# Altium schematic sheet PP6_LCD.SchDoc
size A3
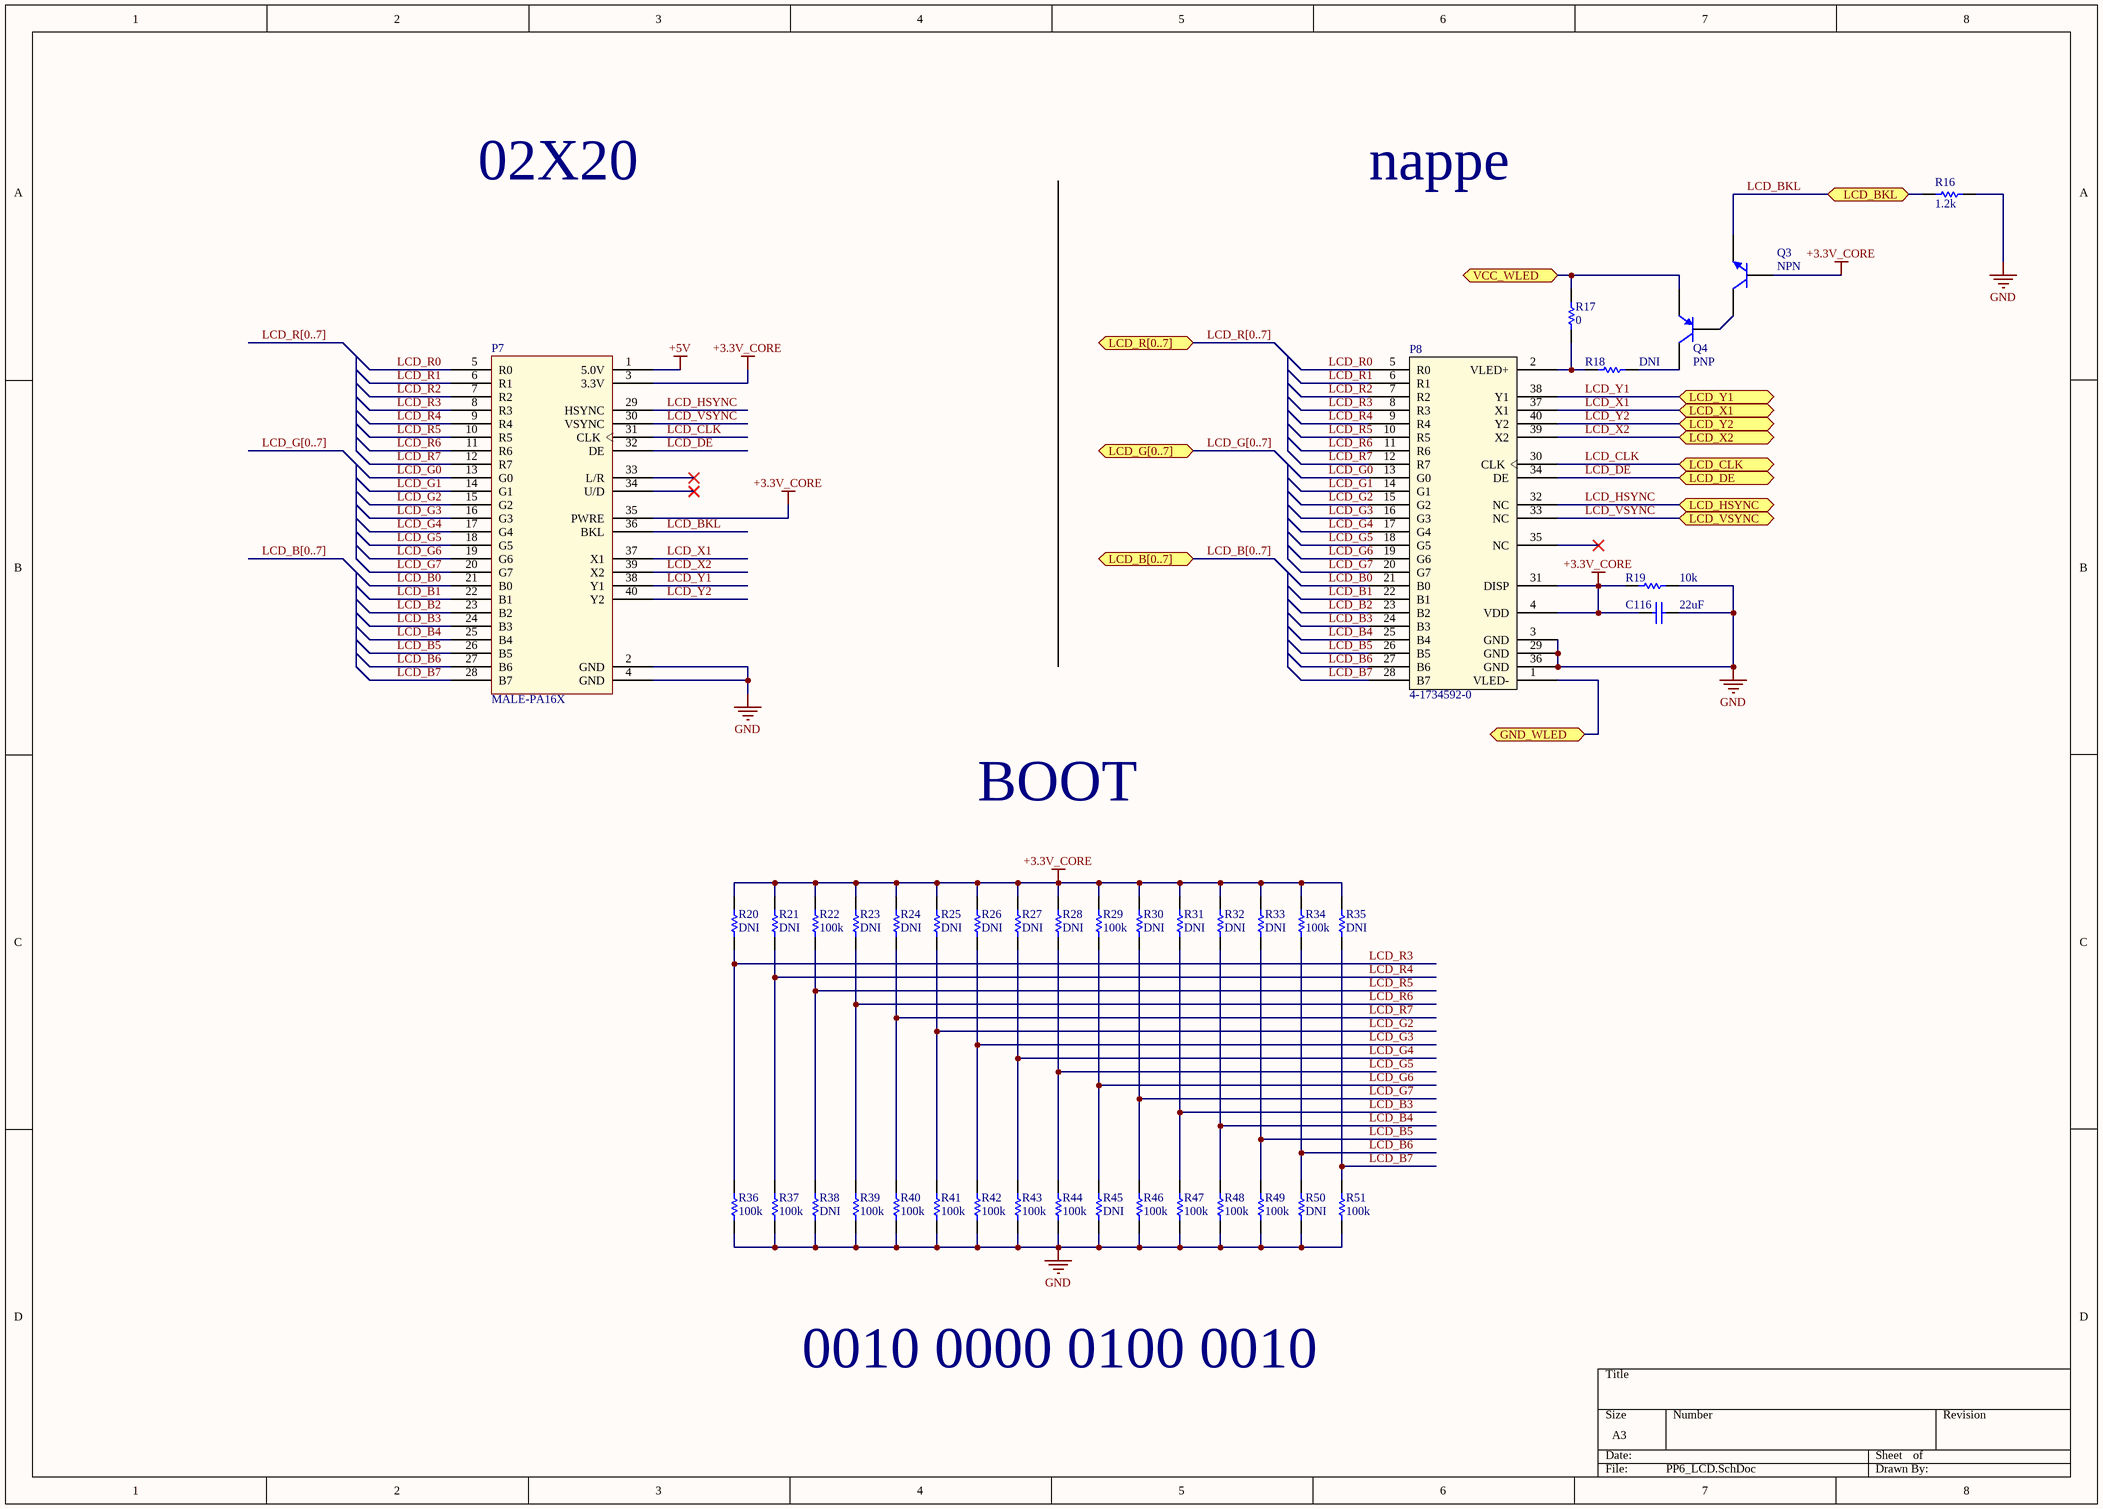
[diagram p0: PP6_LCD.SchDoc]

## Parts
C116  value 22uF  [CAPC1608X08]  (hidden comment: Cap 22uF)
P7  MALE-PA16X  [MALE-PAV16X-2x05]
P8  4-1734592-0  [TE_4-1734592-0]
Q3  NPN  [SOT95P234X111-3N]
Q4  PNP  [SOT95P234X111-3N]
R16  value 1.2k  [RESC1608X05]  (hidden comment: Res 1.2k)
R17  value 0  [RESC1608X05]  (hidden comment: Res 0 Ohm)
R18  value DNI  [RESC1608X05]  (hidden comment: Res)  (no BOM)
R19  value 10k  [RESC1608X05]  (hidden comment: Res 10k)
R20  value DNI  [RESC1608X05]  (hidden comment: Res)  (no BOM)
R21  value DNI  [RESC1608X05]  (hidden comment: Res)  (no BOM)
R22  value 100k  [RESC1608X05]  (hidden comment: Res 100k)
R23  value DNI  [RESC1608X05]  (hidden comment: Res)  (no BOM)
R24  value DNI  [RESC1608X05]  (hidden comment: Res)  (no BOM)
R25  value DNI  [RESC1608X05]  (hidden comment: Res)  (no BOM)
R26  value DNI  [RESC1608X05]  (hidden comment: Res)  (no BOM)
R27  value DNI  [RESC1608X05]  (hidden comment: Res)  (no BOM)
R28  value DNI  [RESC1608X05]  (hidden comment: Res)  (no BOM)
R29  value 100k  [RESC1608X05]  (hidden comment: Res 100k)
R30  value DNI  [RESC1608X05]  (hidden comment: Res)  (no BOM)
R31  value DNI  [RESC1608X05]  (hidden comment: Res)  (no BOM)
R32  value DNI  [RESC1608X05]  (hidden comment: Res)  (no BOM)
R33  value DNI  [RESC1608X05]  (hidden comment: Res)  (no BOM)
R34  value 100k  [RESC1608X05]  (hidden comment: Res 100k)
R35  value DNI  [RESC1608X05]  (hidden comment: Res)  (no BOM)
R36  value 100k  [RESC1608X05]  (hidden comment: Res 100k)
R37  value 100k  [RESC1608X05]  (hidden comment: Res 100k)
R38  value DNI  [RESC1608X05]  (hidden comment: Res)  (no BOM)
R39  value 100k  [RESC1608X05]  (hidden comment: Res 100k)
R40  value 100k  [RESC1608X05]  (hidden comment: Res 100k)
R41  value 100k  [RESC1608X05]  (hidden comment: Res 100k)
R42  value 100k  [RESC1608X05]  (hidden comment: Res 100k)
R43  value 100k  [RESC1608X05]  (hidden comment: Res 100k)
R44  value 100k  [RESC1608X05]  (hidden comment: Res 100k)
R45  value DNI  [RESC1608X05]  (hidden comment: Res)  (no BOM)
R46  value 100k  [RESC1608X05]  (hidden comment: Res 100k)
R47  value 100k  [RESC1608X05]  (hidden comment: Res 100k)
R48  value 100k  [RESC1608X05]  (hidden comment: Res 100k)
R49  value 100k  [RESC1608X05]  (hidden comment: Res 100k)
R50  value DNI  [RESC1608X05]  (hidden comment: Res)  (no BOM)
R51  value 100k  [RESC1608X05]  (hidden comment: Res 100k)

## Ports
GND_WLED, LCD_B[0..7], LCD_BKL, LCD_CLK, LCD_DE, LCD_G[0..7], LCD_HSYNC, LCD_R[0..7], LCD_VSYNC, LCD_X1, LCD_X2, LCD_Y1, LCD_Y2, VCC_WLED

## Nets
+3.3V_CORE: C116.2 P7.3(3.3V) P7.35(PWRE) P8.4(VDD) P8.31(DISP) Q3.2(B) R19.2 R20.2 R21.2 R22.2 R23.2 R24.2 R25.2 R26.2 R27.2 R28.2 R29.2 R30.2 R31.2 R32.2 R33.2 R34.2 R35.2
+5V: P7.1(5.0V)
GND: C116.1 P7.2(GND) P7.4(GND) P8.3(GND) P8.29(GND) P8.36(GND) R16.1 R19.1 R36.1 R37.1 R38.1 R39.1 R40.1 R41.1 R42.1 R43.1 R44.1 R45.1 R46.1 R47.1 R48.1 R49.1 R50.1 R51.1
GND_WLED: P8.1(VLED-) ; port GND_WLED
LCD_B0: P7.21(B0) P8.21(B0)
LCD_B1: P7.22(B1) P8.22(B1)
LCD_B2: P7.23(B2) P8.23(B2)
LCD_B3: P7.24(B3) P8.24(B3) R31.1 R47.2
LCD_B4: P7.25(B4) P8.25(B4) R32.1 R48.2
LCD_B5: P7.26(B5) P8.26(B5) R33.1 R49.2
LCD_B6: P7.27(B6) P8.27(B6) R34.1 R50.2
LCD_B7: P7.28(B7) P8.28(B7) R35.1 R51.2
LCD_BKL: P7.36(BKL) Q3.3(E) R16.2 ; port LCD_BKL
LCD_CLK: P7.31(CLK) P8.30(CLK) ; port LCD_CLK
LCD_DE: P7.32(DE) P8.34(DE) ; port LCD_DE
LCD_G0: P7.13(G0) P8.13(G0)
LCD_G1: P7.14(G1) P8.14(G1)
LCD_G2: P7.15(G2) P8.15(G2) R25.1 R41.2
LCD_G3: P7.16(G3) P8.16(G3) R26.1 R42.2
LCD_G4: P7.17(G4) P8.17(G4) R27.1 R43.2
LCD_G5: P7.18(G5) P8.18(G5) R28.1 R44.2
LCD_G6: P7.19(G6) P8.19(G6) R29.1 R45.2
LCD_G7: P7.20(G7) P8.20(G7) R30.1 R46.2
LCD_HSYNC: P7.29(HSYNC) P8.32(NC) ; port LCD_HSYNC
LCD_R0: P7.5(R0) P8.5(R0)
LCD_R1: P7.6(R1) P8.6(R1)
LCD_R2: P7.7(R2) P8.7(R2)
LCD_R3: P7.8(R3) P8.8(R3) R20.1 R36.2
LCD_R4: P7.9(R4) P8.9(R4) R21.1 R37.2
LCD_R5: P7.10(R5) P8.10(R5) R22.1 R38.2
LCD_R6: P7.11(R6) P8.11(R6) R23.1 R39.2
LCD_R7: P7.12(R7) P8.12(R7) R24.1 R40.2
LCD_VSYNC: P7.30(VSYNC) P8.33(NC) ; port LCD_VSYNC
LCD_X1: P7.37(X1) P8.37(X1) ; port LCD_X1
LCD_X2: P7.39(X2) P8.39(X2) ; port LCD_X2
LCD_Y1: P7.38(Y1) P8.38(Y1) ; port LCD_Y1
LCD_Y2: P7.40(Y2) P8.40(Y2) ; port LCD_Y2
VCC_WLED: Q4.3(E) R17.2 ; port VCC_WLED
NetP8_2: P8.2(VLED+) R17.1 R18.2
NetQ3_1: Q3.1(C) Q4.2(B)
NetQ4_1: Q4.1(C) R18.1

Not connected (* = marked no-connect by the designer): P7 33(L/R)* 34(U/D)*; P8 35(NC)*

## Buses and harness runs
bus LCD_B[0..7]
bus LCD_B[0..7] = port LCD_B[0..7]
bus LCD_G[0..7]
bus LCD_G[0..7] = port LCD_G[0..7]
bus LCD_R[0..7]
bus LCD_R[0..7] = port LCD_R[0..7]

## Notes on the sheet
- 02X20
- nappe
- BOOT
- 0010 0000 0100 0010

## Library data of the parts
C116 = Cap: Capacitor; Fabricant: MURATA; Fournisseur: Farnell; RefFabricant: GRM188R61A226ME15D; RefFournisseur: 2426957; Case: 0603 [1608 Metric]; DataSheet: http://www.farnell.com/datasheets/2047978.pdf
P7 = MALE-PA16X: Connecteur LCD et Touch screen (limande); RefFabricant: MALE-PAV16X-2x20; Fournisseur: Olimex; RefFournisseur: MALE-PAV16X-2x20; DataSheet: https://www.olimex.com/Products/Components/Connectors/MALE-PAV16X-2x05/resources/MALE-PA16X-2Xxx.jpg; Fabricant: Olimex
P8 = 4-1734592-0: Connecteur LCD et Touch screen; Fabricant: TE CONNECTIVITY; Fournisseur: Farnell; RefFournisseur: 1816399; RefFabricant: 4-1734592-0; DataSheet: http://www.farnell.com/cad/1794473.pdf
Q3 = NPN: NPN Bipolar Transistor; Fabricant: ON SEMICONDUCTOR; Fournisseur: Farnell; RefFournisseur: 9556672; RefFabricant: SMMUN2214LT1G; DataSheet: http://www.farnell.com/datasheets/1813846.pdf
Q4 = PNP: PNP Bipolar Transistor; RefFabricant: SMMUN2114LT1G; Fabricant: ON SEMICONDUCTOR; RefFournisseur: 2724481; Fournisseur: Farnell; DataSheet: http://www.farnell.com/datasheets/2237089.pdf
R16 = Res1: Resistor; Fabricant: TE CONNECTIVITY; Fournisseur: Farnell; RefFabricant: CPF-A-0603B1K2E1; RefFournisseur: 2483896; Case: 0603 [1608 Metric]; DataSheet: http://www.farnell.com/datasheets/1935020.pdf
R17 = Res1: Resistor; Fabricant: VISHAY; Fournisseur: Farnell; RefFabricant: CRCW06030000Z0EB; RefFournisseur: 2616741; Case: 0603 [1608 Metric]
R18 R20 R21 R23-R28 R30-R33 R35 R38 R45 R50 = Res1: Resistor; Case: 0603 [1608 Metric]
R19 = Res1: Resistor; Fabricant: TE CONNECTIVITY; Fournisseur: Farnell; RefFabricant: CRGH0603J10K; RefFournisseur: 2331740; Case: 0603 [1608 Metric]; DataSheet: CRGH0603J10K
R22 R29 R34 R36 R37 R39-R44 R46-R49 R51 = Res1: Resistor; Fabricant: TE CONNECTIVITY; Fournisseur: Farnell; RefFabricant: RN73C1J100KBTDF; RefFournisseur: 2687850; Case: 0603 [1608 Metric]; DataSheet: http://www.farnell.com/datasheets/2189072.pdf